# EAGLE schematic isp (EAGLE 9.6.2)

## Sheet 1 of 5
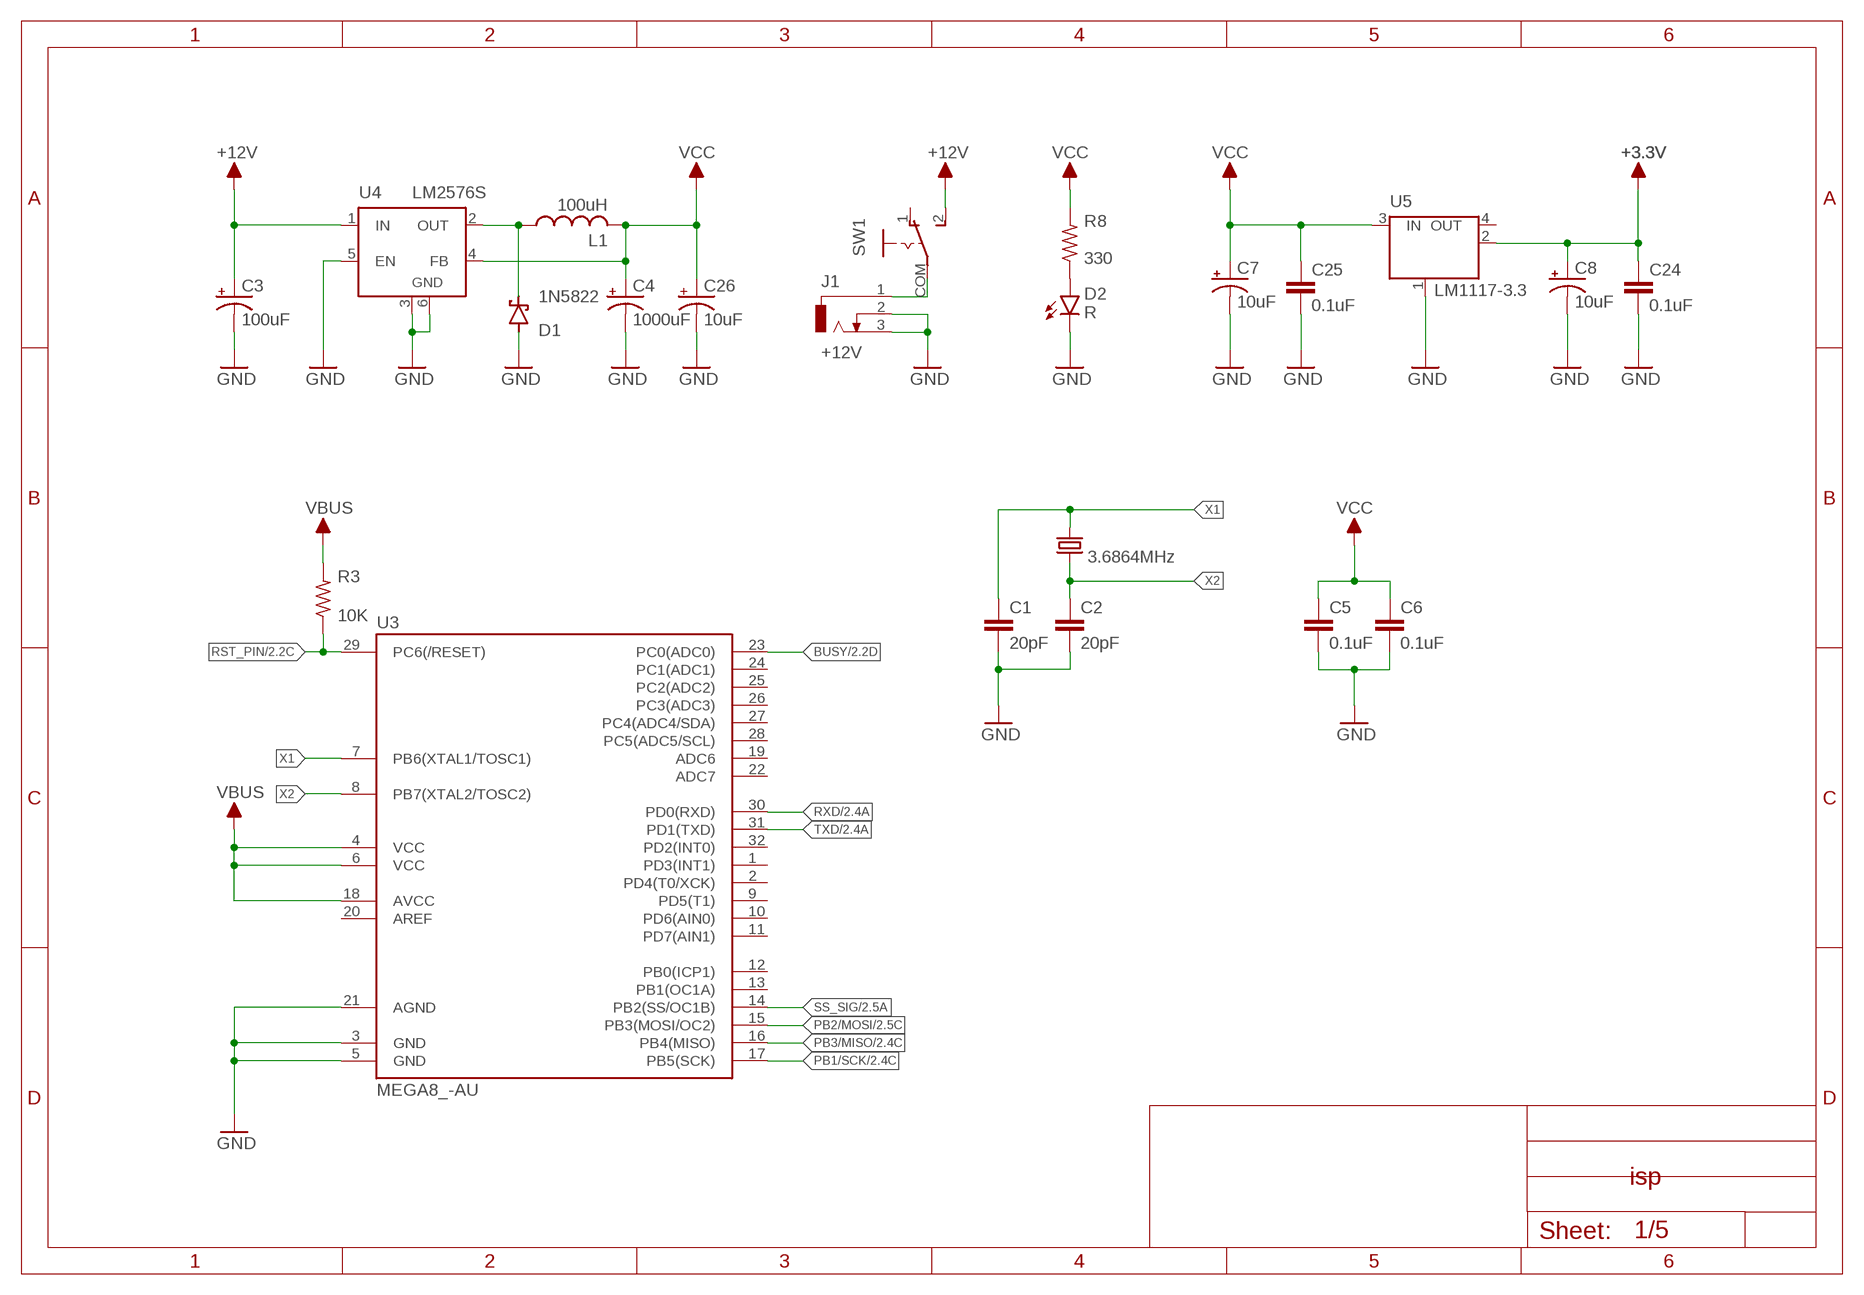
[diagram p0: schematic, sheet 1]

### Parts
C1  20pF  C-EUC0603  [C0603]
C2  20pF  C-EUC0603  [C0603]
C3  100uF  CPOL-US153CLV-0807  [153CLV-0807]
C4  1000uF  MVG_K14  [MVG_K14]
C5  0.1uF  C-EUC0603  [C0603]
C6  0.1uF  C-EUC0603  [C0603]
C7  10uF  CPOL-US153CLV-0605  [153CLV-0605]
C8  10uF  CPOL-US153CLV-0605  [153CLV-0605]
C24  0.1uF  C-EUC0603  [C0603]
C25  0.1uF  C-EUC0603  [C0603]
C26  10uF  CPOL-US153CLV-0605  [153CLV-0605]
D1  1N5822  15KEXXD  [DO201T15]
D2  R  LED3MM  [LED3MM]
J1  +12V  DCJ0303  [DCJ0303]
L1  100uH  SC1280S  [212-032T2]
R3  10K  R-US_R0603  [R0603]
R8  330  R-US_R0603  [R0603]
SW1  SLIDE-SW-DIP  [SLIDE-SW-DIP-SHIELD]
U3  MEGA8_-AU  [TQFP32-08]
U4  LM2576S  LM2596S  [TO263-5]
U5  LM1117-3.3  MC33269ST-3.3T3  [SOT223]
Y1  3.6864MHz  CRYSTALHC49UP  [HC49UP]

### Nets
+3.3V [VCCS]: C8.+ C24.1 U5.2(OUT) ; also sheet 3,5
+12V [12V]: C3.+ SW1.2 U4.1(IN) ; also sheet 5
BUSY: U3.23(PC0(ADC0)) ; also sheet 2
GND: C1.2 C2.2 C3.- C4.- C5.2 C6.2 C7.- C8.- C24.2 C25.2 C26.- D1.A D2.K(C) J1.2 J1.3 U3.3(GND) U3.5(GND) U3.21(AGND) U4.3(GND) U4.5(EN) U4.6(GND) U5.1(GND/ADJ) ; also sheet 2,3,4,5
N$2: D1.C L1.1 U4.2(OUT)
N$9: D2.A R8.1
N$11 [12V]: J1.1 SW1.COM
PB1/SCK: U3.17(PB5(SCK)) ; also sheet 2,3,4
PB2/MOSI: U3.15(PB3(MOSI/OC2)) ; also sheet 2,3,4
PB3/MISO: U3.16(PB4(MISO)) ; also sheet 2,3,4
RST_PIN: R3.1 U3.29(PC6(/RESET)) ; also sheet 2
RXD: U3.30(PD0(RXD)) ; also sheet 2
SS_SIG: U3.14(PB2(SS/OC1B)) ; also sheet 2
TXD: U3.31(PD1(TXD)) ; also sheet 2
VBUS: R3.2 U3.4(VCC) U3.6(VCC) U3.18(AVCC) ; also sheet 2
VCC [VCCS]: C4.+ C5.1 C6.1 C7.+ C25.1 C26.+ L1.2 R8.2 U4.4(FB) U5.3(IN) ; also sheet 3,4,5
X1: C1.1 U3.7(PB6(XTAL1/TOSC1)) Y1.2
X2: C2.1 U3.8(PB7(XTAL2/TOSC2)) Y1.1
Unconnected: SW1.1 U3.1(PD3(INT1)) U3.2(PD4(T0/XCK)) U3.9(PD5(T1)) U3.10(PD6(AIN0)) U3.11(PD7(AIN1)) U3.12(PB0(ICP1)) U3.13(PB1(OC1A)) U3.19(ADC6) U3.20(AREF) U3.22(ADC7) U3.24(PC1(ADC1)) U3.25(PC2(ADC2)) U3.26(PC3(ADC3)) U3.27(PC4(ADC4/SDA)) U3.28(PC5(ADC5/SCL)) U3.32(PD2(INT0)) U5.4(OUT)

## Sheet 2 of 5
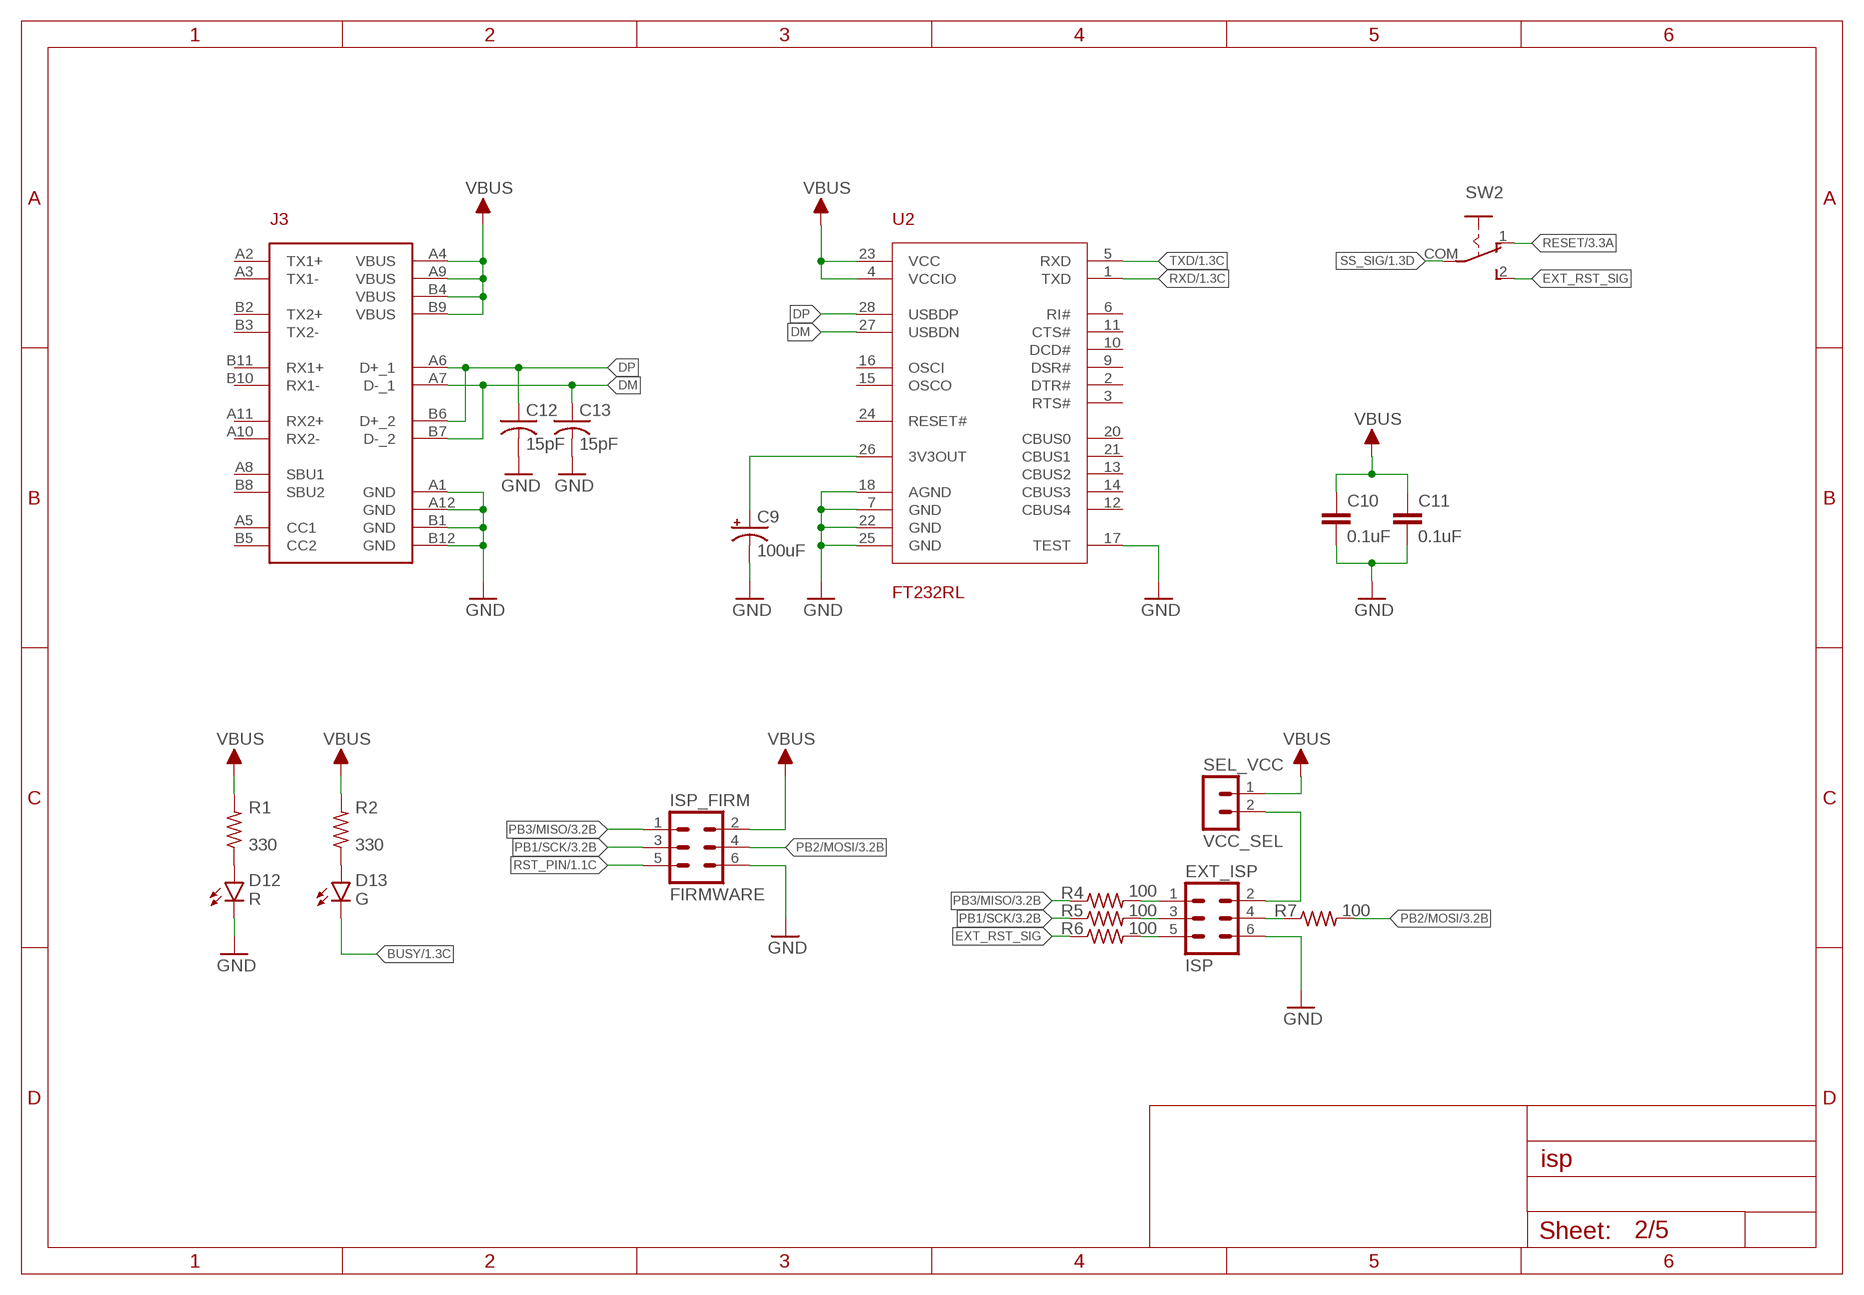
[diagram p1: schematic, sheet 2]

### Parts
C9  100uF  CPOL-US153CLV-0807  [153CLV-0807]
C10  0.1uF  C-EUC0603  [C0603]
C11  0.1uF  C-EUC0603  [C0603]
C12  15pF  C-USC0603  [C0603]
C13  15pF  C-USC0603  [C0603]
D12  R  LED3MM  [LED3MM]
D13  G  LED3MM  [LED3MM]
EXT_ISP  ISP  ML6  [ML6]
ISP_FIRM  FIRMWARE  MA03-2  [MA03-2]
J3  USB-C-SMD  [USB3.1-C-SMD]
R1  330  R-US_R0603  [R0603]
R2  330  R-US_R0603  [R0603]
R4  100  R-US_R0603  [R0603]
R5  100  R-US_R0603  [R0603]
R6  100  R-US_R0603  [R0603]
R7  100  R-US_R0603  [R0603]
SEL_VCC  VCC_SEL  MA02-1  [MA02-1]
SW2  SLIDE-SW-DIP  [SLIDE-SW-DIP-SHIELD]
U2  FT232RL  [SSOP28]

### Nets
BUSY: D13.K(C) ; also sheet 1
DM: C13.1 J3.A7(D-_1) J3.B7(D-_2) U2.27(USBDN)
DP: C12.1 J3.A6(D+_1) J3.B6(D+_2) U2.28(USBDP)
EXT_RST_SIG: R6.1 SW2.2
GND: C9.- C10.2 C11.2 C12.2 C13.2 D12.K(C) EXT_ISP.6 ISP_FIRM.6 J3.A1(GND) J3.A12(GND) J3.B1(GND) J3.B12(GND) U2.7(GND) U2.17(TEST) U2.18(AGND) U2.22(GND) U2.25(GND) ; also sheet 1,3,4,5
N$1: D12.A R1.1
N$3: D13.A R2.1
N$4: EXT_ISP.1 R4.2
N$5: EXT_ISP.3 R5.2
N$6: EXT_ISP.5 R6.2
N$7: EXT_ISP.4 R7.1
N$8: EXT_ISP.2 SEL_VCC.2
N$10: C9.+ U2.26(3V3OUT)
PB1/SCK: ISP_FIRM.3 R5.1 ; also sheet 1,3,4
PB2/MOSI: ISP_FIRM.4 R7.2 ; also sheet 1,3,4
PB3/MISO: ISP_FIRM.1 R4.1 ; also sheet 1,3,4
RESET: SW2.1 ; also sheet 3
RST_PIN: ISP_FIRM.5 ; also sheet 1
RXD: U2.1(TXD) ; also sheet 1
SS_SIG: SW2.COM ; also sheet 1
TXD: U2.5(RXD) ; also sheet 1
VBUS: C10.1 C11.1 ISP_FIRM.2 J3.A4(VBUS) J3.A9(VBUS) J3.B4(VBUS) J3.B9(VBUS) R1.2 R2.2 SEL_VCC.1 U2.4(VCCIO) U2.23(VCC) ; also sheet 1
Unconnected: J3.A2(TX1+) J3.A3(TX1-) J3.A5(CC1) J3.A8(SBU1) J3.A10(RX2-) J3.A11(RX2+) J3.B2(TX2+) J3.B3(TX2-) J3.B5(CC2) J3.B8(SBU2) J3.B10(RX1-) J3.B11(RX1+) U2.2(DTR#) U2.3(RTS#) U2.6(RI#) U2.8(NC) U2.9(DSR#) U2.10(DCD#) U2.11(CTS#) U2.12(CBUS4) U2.13(CBUS2) U2.14(CBUS3) U2.15(OSCO) U2.16(OSCI) U2.19(NC) U2.20(CBUS0) U2.21(CBUS1) U2.24(RESET#)

## Sheet 3 of 5
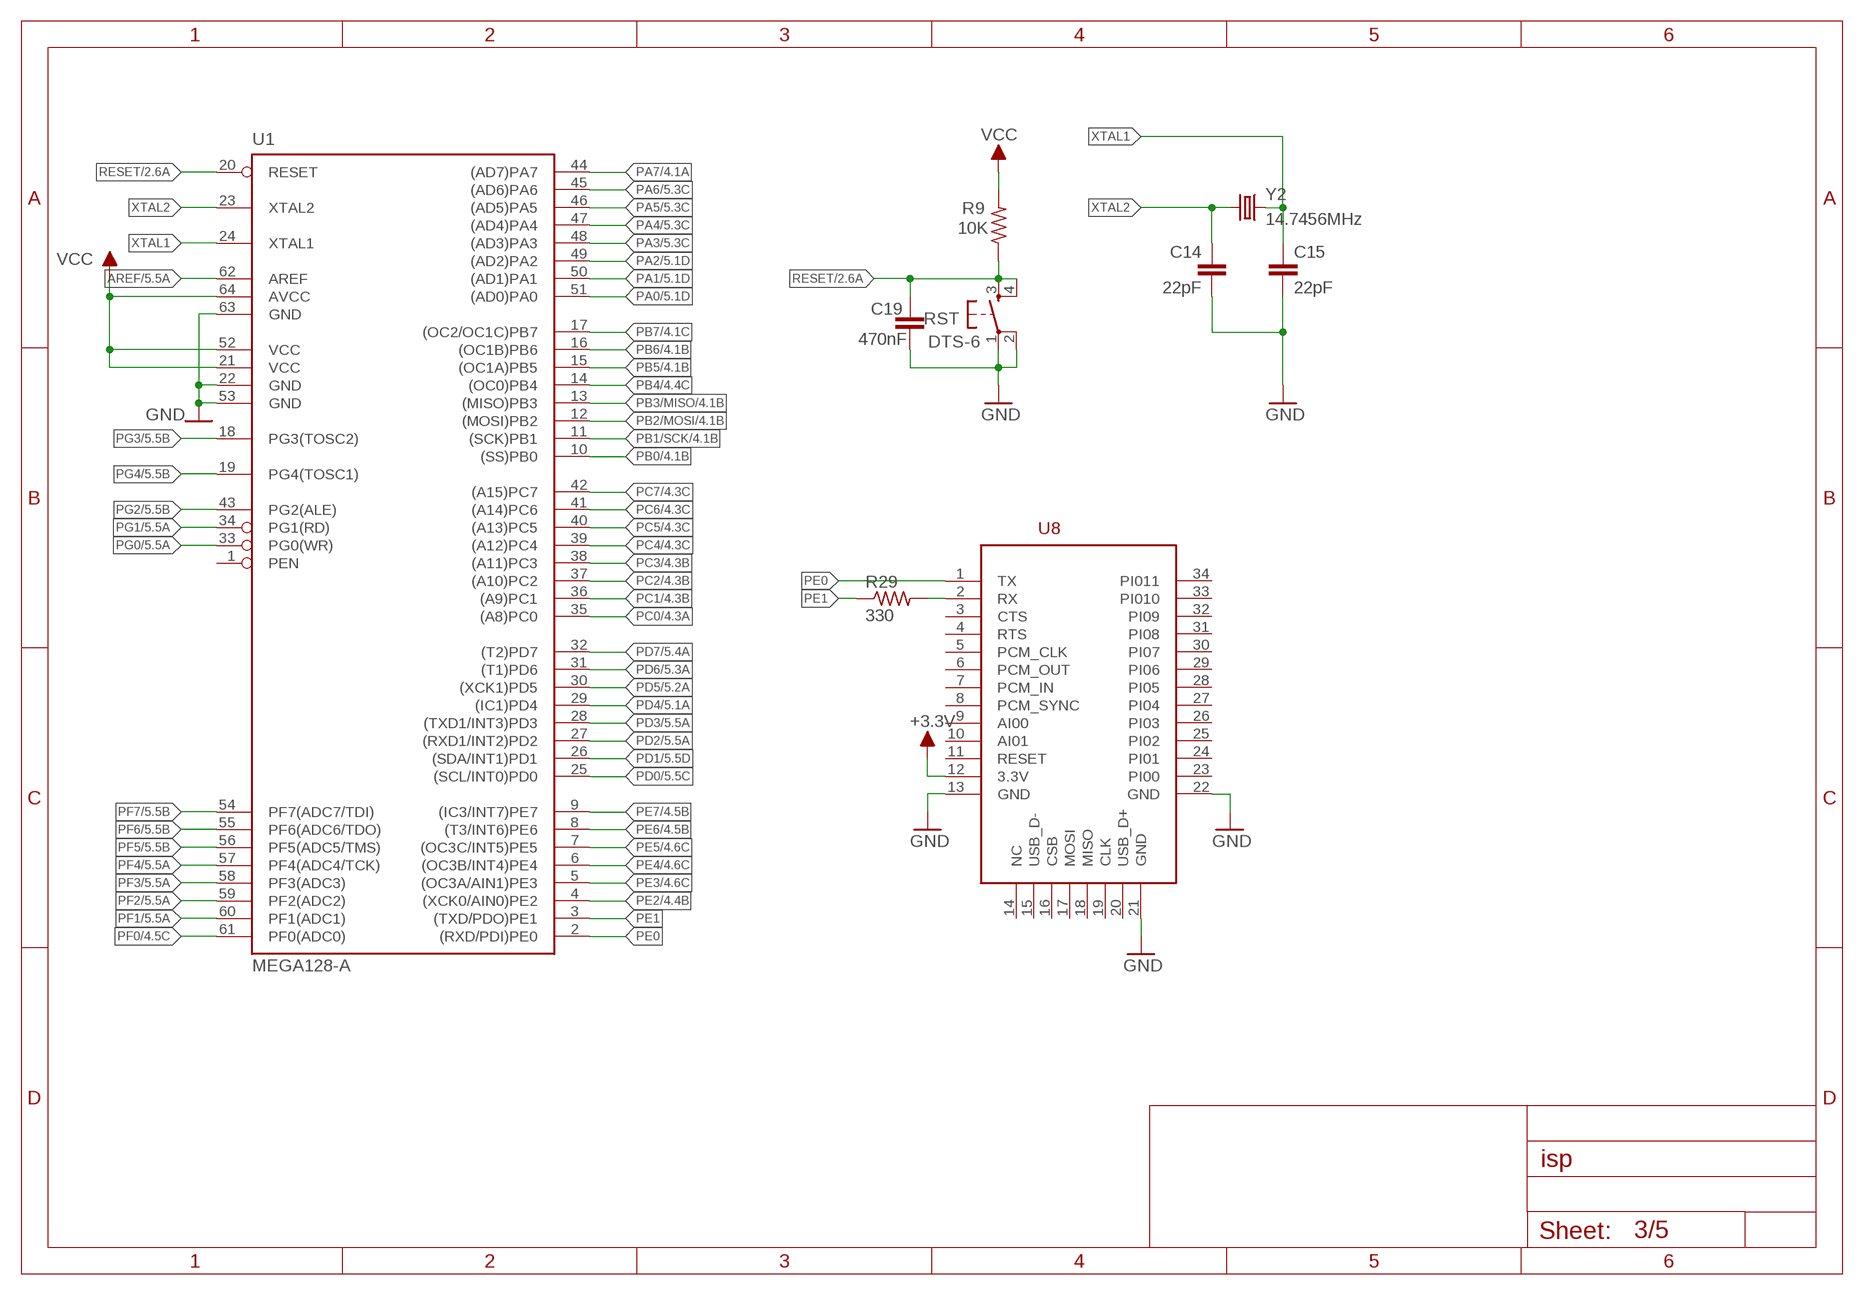
[diagram p2: schematic, sheet 3]

### Parts
C14  22pF  C-EUC0603  [C0603]
C15  22pF  C-EUC0603  [C0603]
C19  470nF  C-EUC1206  [C1206]
R9  10K  R-US_R0603  [R0603]
R29  330  R-US_R0603  [R0603]
RST  DTS-6  [DTS-6]
U1  MEGA128-A  [TQFP64]
U8  HC06-SMD  [HC06-SMD]
Y2  14.7456MHz  CRYSTALHC49UP  [HC49UP]

### Nets
+3.3V [VCCS]: U8.12(3.3V) ; also sheet 1,5
AREF: U1.62(AREF) ; also sheet 5
GND: C14.1 C15.2 C19.2 RST.1 RST.2 U1.22(GND) U1.53(GND) U1.63(GND) U8.13(GND) U8.21(GND) U8.22(GND) ; also sheet 1,2,4,5
N$28: R29.2 U8.2(RX)
PA0: U1.51((AD0)PA0) ; also sheet 5
PA1: U1.50((AD1)PA1) ; also sheet 5
PA2: U1.49((AD2)PA2) ; also sheet 5
PA3: U1.48((AD3)PA3) ; also sheet 5
PA4: U1.47((AD4)PA4) ; also sheet 5
PA5: U1.46((AD5)PA5) ; also sheet 5
PA6: U1.45((AD6)PA6) ; also sheet 5
PA7: U1.44((AD7)PA7) ; also sheet 4
PB0: U1.10((SS)PB0) ; also sheet 4
PB1/SCK: U1.11((SCK)PB1) ; also sheet 1,2,4
PB2/MOSI: U1.12((MOSI)PB2) ; also sheet 1,2,4
PB3/MISO: U1.13((MISO)PB3) ; also sheet 1,2,4
PB4: U1.14((OC0)PB4) ; also sheet 4
PB5: U1.15((OC1A)PB5) ; also sheet 4
PB6: U1.16((OC1B)PB6) ; also sheet 4
PB7: U1.17((OC2/OC1C)PB7) ; also sheet 4
PC0: U1.35((A8)PC0) ; also sheet 4
PC1: U1.36((A9)PC1) ; also sheet 4
PC2: U1.37((A10)PC2) ; also sheet 4
PC3: U1.38((A11)PC3) ; also sheet 4
PC4: U1.39((A12)PC4) ; also sheet 4
PC5: U1.40((A13)PC5) ; also sheet 4
PC6: U1.41((A14)PC6) ; also sheet 4
PC7: U1.42((A15)PC7) ; also sheet 4
PD0: U1.25((SCL/INT0)PD0) ; also sheet 5
PD1: U1.26((SDA/INT1)PD1) ; also sheet 5
PD2: U1.27((RXD1/INT2)PD2) ; also sheet 5
PD3: U1.28((TXD1/INT3)PD3) ; also sheet 5
PD4: U1.29((IC1)PD4) ; also sheet 5
PD5: U1.30((XCK1)PD5) ; also sheet 5
PD6: U1.31((T1)PD6) ; also sheet 5
PD7: U1.32((T2)PD7) ; also sheet 5
PE0: U1.2((RXD/PDI)PE0) U8.1(TX)
PE1: R29.1 U1.3((TXD/PDO)PE1)
PE2: U1.4((XCK0/AIN0)PE2) ; also sheet 4
PE3: U1.5((OC3A/AIN1)PE3) ; also sheet 4
PE4: U1.6((OC3B/INT4)PE4) ; also sheet 4
PE5: U1.7((OC3C/INT5)PE5) ; also sheet 4
PE6: U1.8((T3/INT6)PE6) ; also sheet 4
PE7: U1.9((IC3/INT7)PE7) ; also sheet 4
PF0: U1.61(PF0(ADC0)) ; also sheet 4
PF1: U1.60(PF1(ADC1)) ; also sheet 5
PF2: U1.59(PF2(ADC2)) ; also sheet 5
PF3: U1.58(PF3(ADC3)) ; also sheet 5
PF4: U1.57(PF4(ADC4/TCK)) ; also sheet 5
PF5: U1.56(PF5(ADC5/TMS)) ; also sheet 5
PF6: U1.55(PF6(ADC6/TDO)) ; also sheet 5
PF7: U1.54(PF7(ADC7/TDI)) ; also sheet 5
PG0: U1.33(PG0(WR)) ; also sheet 5
PG1: U1.34(PG1(RD)) ; also sheet 5
PG2: U1.43(PG2(ALE)) ; also sheet 5
PG3: U1.18(PG3(TOSC2)) ; also sheet 5
PG4: U1.19(PG4(TOSC1)) ; also sheet 5
RESET: C19.1 R9.1 RST.3 RST.4 U1.20(RESET) ; also sheet 2
VCC [VCCS]: R9.2 U1.21(VCC) U1.52(VCC) U1.64(AVCC) ; also sheet 1,4,5
XTAL1: C15.1 U1.24(XTAL1) Y2.1
XTAL2: C14.2 U1.23(XTAL2) Y2.2
Unconnected: U1.1(PEN) U8.3(CTS) U8.4(RTS) U8.5(PCM_CLK) U8.6(PCM_OUT) U8.7(PCM_IN) U8.8(PCM_SYNC) U8.9(AI00) U8.10(AI01) U8.11(RESET) U8.14(NC) U8.15(USB_D-) U8.16(CSB) U8.17(MOSI) U8.18(MISO) U8.19(CLK) U8.20(USB_D+) U8.23(PI00) U8.24(PI01) U8.25(PI02) U8.26(PI03) U8.27(PI04) U8.28(PI05) U8.29(PI06) U8.30(PI07) U8.31(PI08) U8.32(PI09) U8.33(PI010) U8.34(PI011)

## Sheet 4 of 5
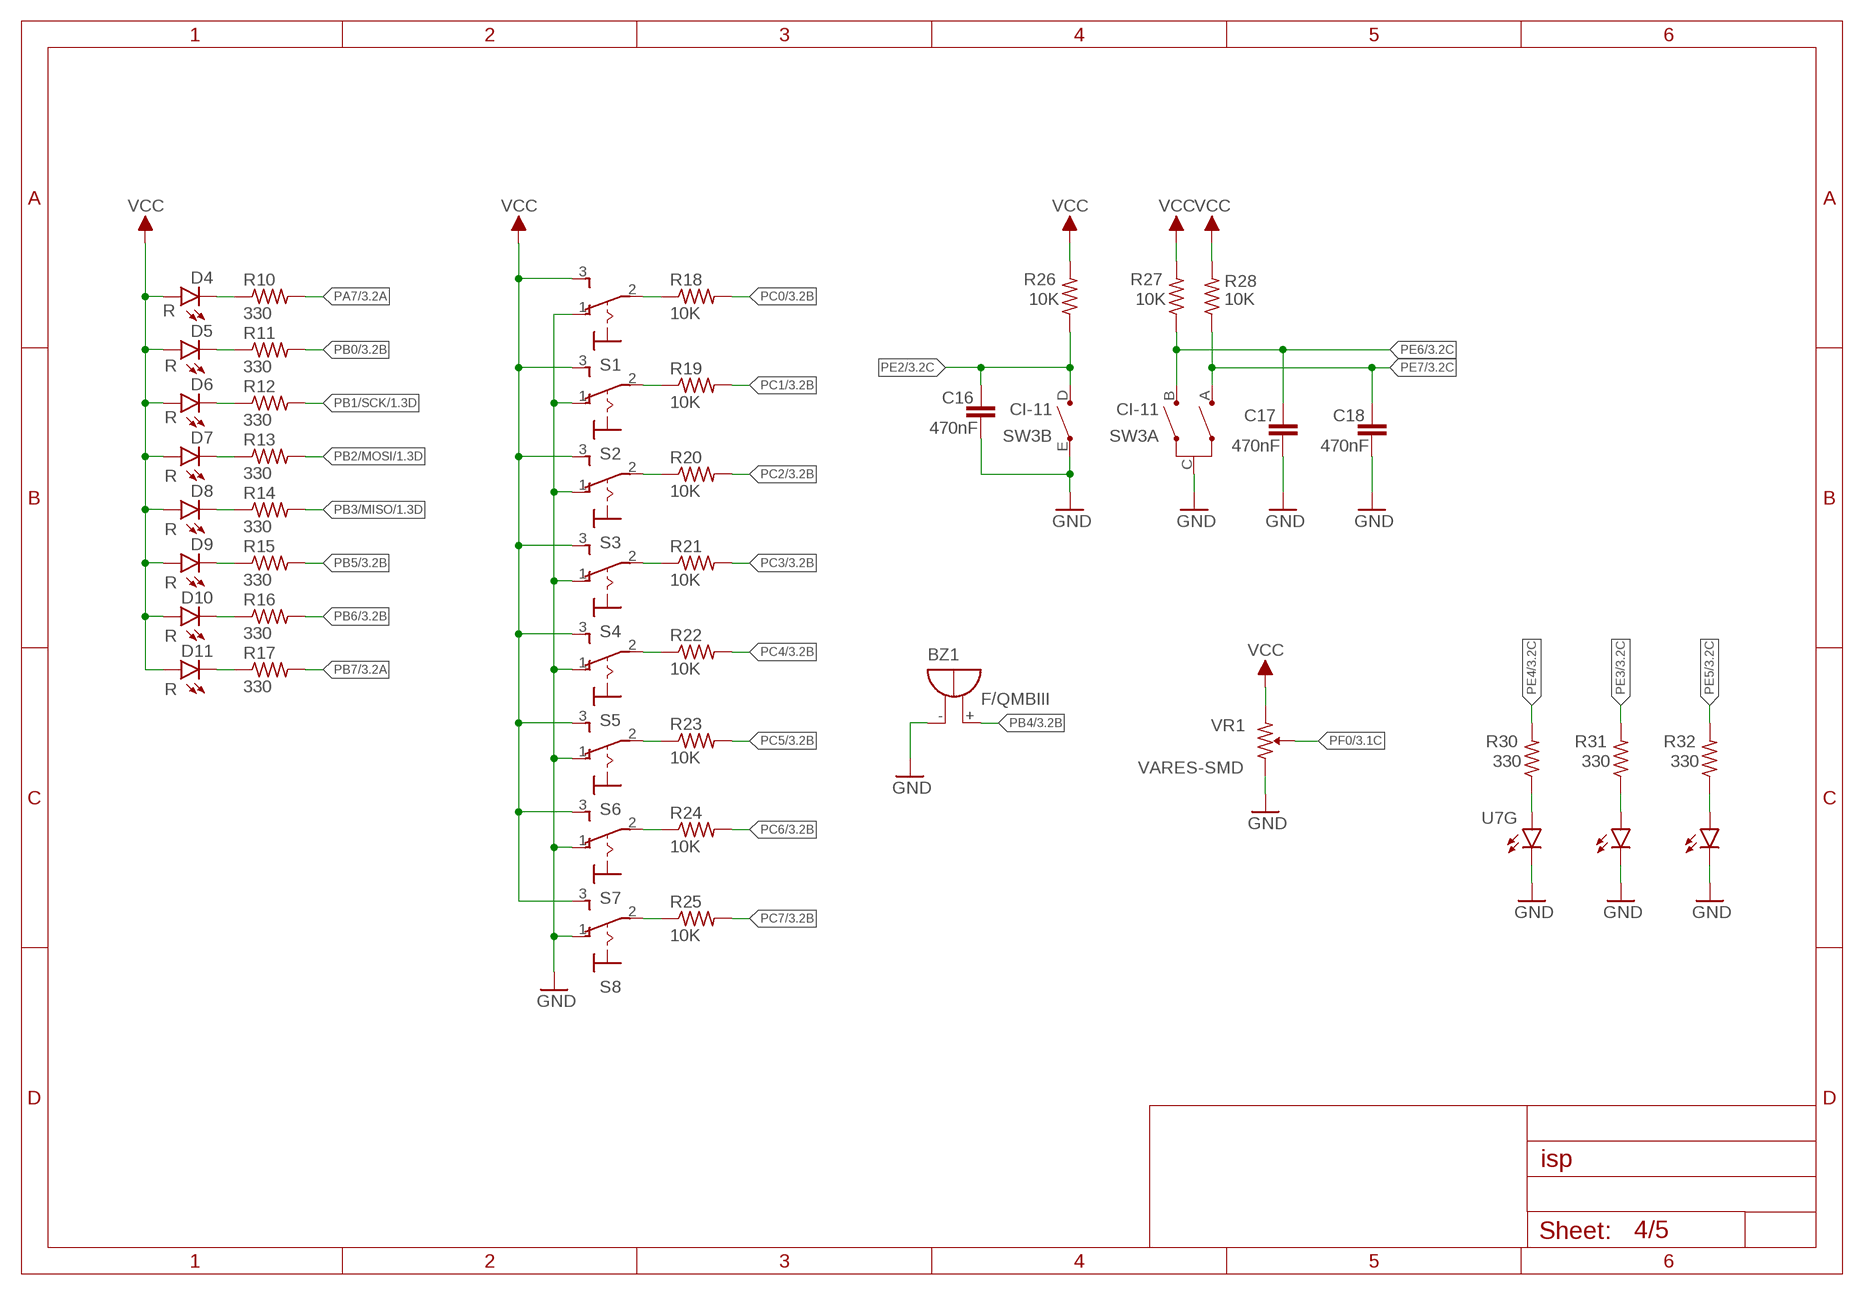
[diagram p3: schematic, sheet 4]

### Parts
BZ1  F/QMBIII  [F/QMBIII]
C16  470nF  C-EUC1206  [C1206]
C17  470nF  C-EUC1206  [C1206]
C18  470nF  C-EUC1206  [C1206]
D4  R  LED3MM  [LED3MM]
D5  R  LED3MM  [LED3MM]
D6  R  LED3MM  [LED3MM]
D7  R  LED3MM  [LED3MM]
D8  R  LED3MM  [LED3MM]
D9  R  LED3MM  [LED3MM]
D10  R  LED3MM  [LED3MM]
D11  R  LED3MM  [LED3MM]
R10  330  R-US_R0603  [R0603]
R11  330  R-US_R0603  [R0603]
R12  330  R-US_R0603  [R0603]
R13  330  R-US_R0603  [R0603]
R14  330  R-US_R0603  [R0603]
R15  330  R-US_R0603  [R0603]
R16  330  R-US_R0603  [R0603]
R17  330  R-US_R0603  [R0603]
R18  10K  R-US_R0603  [R0603]
R19  10K  R-US_R0603  [R0603]
R20  10K  R-US_R0603  [R0603]
R21  10K  R-US_R0603  [R0603]
R22  10K  R-US_R0603  [R0603]
R23  10K  R-US_R0603  [R0603]
R24  10K  R-US_R0603  [R0603]
R25  10K  R-US_R0603  [R0603]
R26  10K  R-US_R0603  [R0603]
R27  10K  R-US_R0603  [R0603]
R28  10K  R-US_R0603  [R0603]
R30  330  R-US_R0603  [R0603]
R31  330  R-US_R0603  [R0603]
R32  330  R-US_R0603  [R0603]
S1  M9040P  [M9040P]
S2  M9040P  [M9040P]
S3  M9040P  [M9040P]
S4  M9040P  [M9040P]
S5  M9040P  [M9040P]
S6  M9040P  [M9040P]
S7  M9040P  [M9040P]
S8  M9040P  [M9040P]
SW3  CI-11  [CI-11]
U7  LP2C63-ST-RGB-SR0  [LP2C63-ST-RGB-SR0]
VR1  VARES-SMD  [VARES-SMD]

### Nets
GND: BZ1.-(+) C16.2 C17.2 C18.2 S1.1(O) S2.1(O) S3.1(O) S4.1(O) S5.1(O) S6.1(O) S7.1(O) S8.1(O) SW3.C(A:C) SW3.E(B:E) U7.4(B:C) U7.5(R:C) U7.6(G:C) VR1.1 ; also sheet 1,2,3,5
N$12: D4.K(C) R10.1
N$13: D5.K(C) R11.1
N$14: D6.K(C) R12.1
N$15: D7.K(C) R13.1
N$16: D8.K(C) R14.1
N$17: D9.K(C) R15.1
N$18: D10.K(C) R16.1
N$19: D11.K(C) R17.1
N$20: R18.1 S1.2(P)
N$21: R19.1 S2.2(P)
N$22: R20.1 S3.2(P)
N$23: R21.1 S4.2(P)
N$24: R22.1 S5.2(P)
N$25: R23.1 S6.2(P)
N$26: R24.1 S7.2(P)
N$27: R25.1 S8.2(P)
N$29: R30.1 U7.1(G:A)
N$30: R31.1 U7.2(R:A)
N$31: R32.1 U7.3(B:A)
PA7: R10.2 ; also sheet 3
PB0: R11.2 ; also sheet 3
PB1/SCK: R12.2 ; also sheet 1,2,3
PB2/MOSI: R13.2 ; also sheet 1,2,3
PB3/MISO: R14.2 ; also sheet 1,2,3
PB4: BZ1.+(-) ; also sheet 3
PB5: R15.2 ; also sheet 3
PB6: R16.2 ; also sheet 3
PB7: R17.2 ; also sheet 3
PC0: R18.2 ; also sheet 3
PC1: R19.2 ; also sheet 3
PC2: R20.2 ; also sheet 3
PC3: R21.2 ; also sheet 3
PC4: R22.2 ; also sheet 3
PC5: R23.2 ; also sheet 3
PC6: R24.2 ; also sheet 3
PC7: R25.2 ; also sheet 3
PE2: C16.1 R26.1 SW3.D(B:D) ; also sheet 3
PE3: R31.2 ; also sheet 3
PE4: R30.2 ; also sheet 3
PE5: R32.2 ; also sheet 3
PE6: C17.1 R27.1 SW3.B(A:B) ; also sheet 3
PE7: C18.1 R28.1 SW3.A(A:A) ; also sheet 3
PF0: VR1.2 ; also sheet 3
VCC [VCCS]: D4.A D5.A D6.A D7.A D8.A D9.A D10.A D11.A R26.2 R27.2 R28.2 S1.3(S) S2.3(S) S3.3(S) S4.3(S) S5.3(S) S6.3(S) S7.3(S) S8.3(S) VR1.3 ; also sheet 1,3,5
Unconnected: U7.TH(TH:TH)

## Sheet 5 of 5
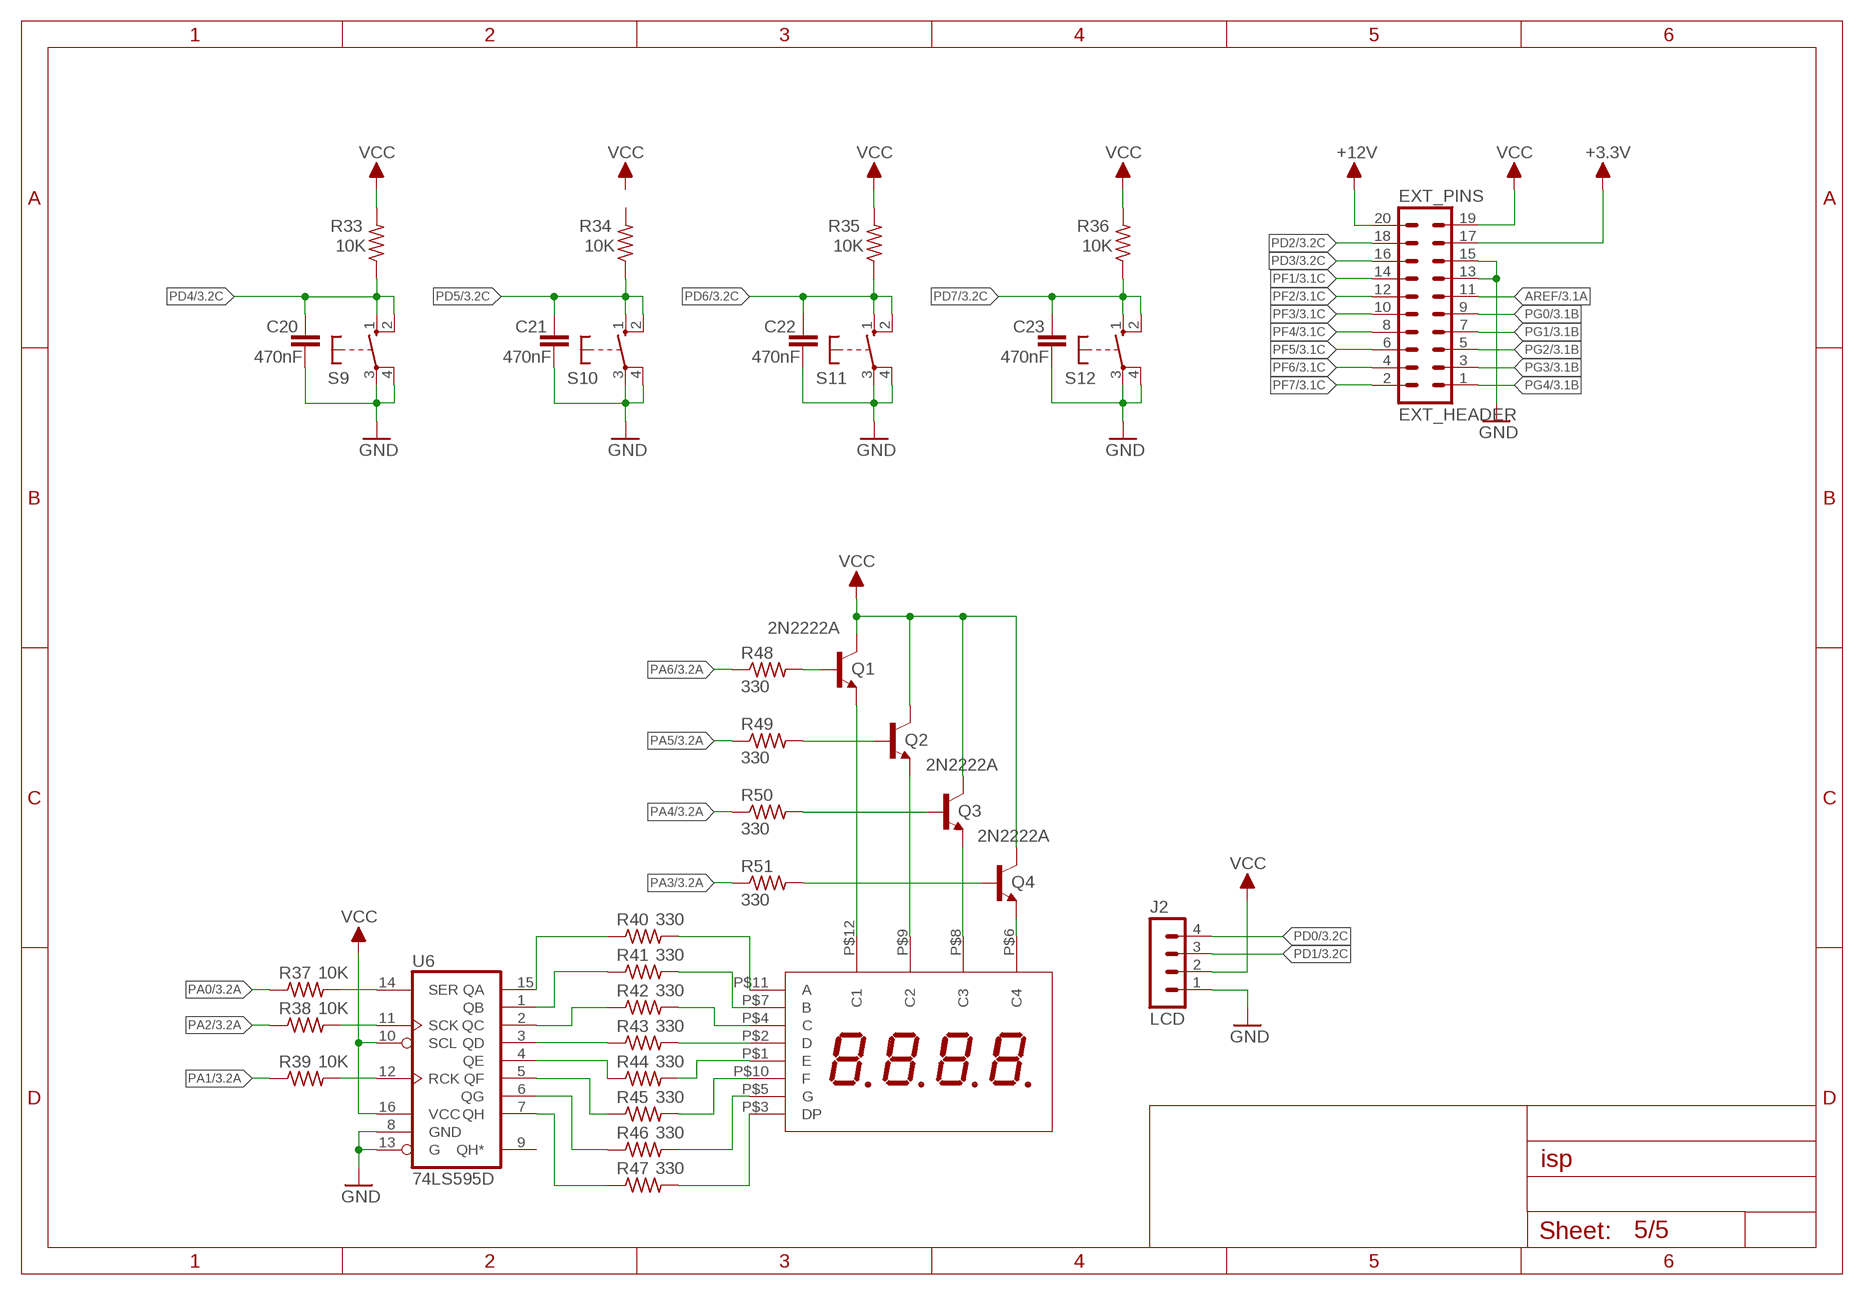
[diagram p4: schematic, sheet 5]

### Parts
C20  470nF  C-EUC1206  [C1206]
C21  470nF  C-EUC1206  [C1206]
C22  470nF  C-EUC1206  [C1206]
C23  470nF  C-EUC1206  [C1206]
D3  4CH_FND-DIP  [4CH_FND-DIP]
EXT_PINS  EXT_HEADER  MA10-2  [MA10-2]
J2  LCD  MA04-1  [MA04-1]
Q1  2N2222A  -NPN-TO92-EBC  [TO92-EBC]
Q2  2N2222A  -NPN-TO92-EBC  [TO92-EBC]
Q3  2N2222A  -NPN-TO92-EBC  [TO92-EBC]
Q4  2N2222A  -NPN-TO92-EBC  [TO92-EBC]
R33  10K  R-US_R0603  [R0603]
R34  10K  R-US_R0603  [R0603]
R35  10K  R-US_R0603  [R0603]
R36  10K  R-US_R0603  [R0603]
R37  10K  R-US_R0603  [R0603]
R38  10K  R-US_R0603  [R0603]
R39  10K  R-US_R0603  [R0603]
R40  330  R-US_R0603  [R0603]
R41  330  R-US_R0603  [R0603]
R42  330  R-US_R0603  [R0603]
R43  330  R-US_R0603  [R0603]
R44  330  R-US_R0603  [R0603]
R45  330  R-US_R0603  [R0603]
R46  330  R-US_R0603  [R0603]
R47  330  R-US_R0603  [R0603]
R48  330  R-US_R0603  [R0603]
R49  330  R-US_R0603  [R0603]
R50  330  R-US_R0603  [R0603]
R51  330  R-US_R0603  [R0603]
S9  RACON12  [RACON12]
S10  RACON12  [RACON12]
S11  RACON12  [RACON12]
S12  RACON12  [RACON12]
U6  74LS595D  [SO16]

### Nets
+3.3V [VCCS]: EXT_PINS.17 ; also sheet 1,3
+12V [12V]: EXT_PINS.20 ; also sheet 1
AREF: EXT_PINS.11 ; also sheet 3
GND: C20.2 C21.2 C22.2 C23.2 EXT_PINS.13 EXT_PINS.15 J2.1 S9.3(P) S9.4(P) S10.3(P) S10.4(P) S11.3(P) S11.4(P) S12.3(P) S12.4(P) U6.8(GND) U6.13(G) ; also sheet 1,2,3,4
N$32: R37.2 U6.14(SER)
N$33: R39.2 U6.12(RCK)
N$34: Q1.B R48.2
N$35: Q2.B R49.2
N$36: Q3.B R50.2
N$37: Q4.B R51.2
N$38: D3.P$12(C1) Q1.E
N$39: D3.P$9(C2) Q2.E
N$40: R38.2 U6.11(SCK)
N$41: R40.1 U6.15(QA)
N$42: R41.1 U6.1(QB)
N$43: R42.1 U6.2(QC)
N$44: R43.1 U6.3(QD)
N$45: R44.1 U6.4(QE)
N$46: R45.1 U6.5(QF)
N$47: R46.1 U6.6(QG)
N$48: R47.1 U6.7(QH)
N$49: D3.P$11(A) R40.2
N$50: D3.P$7(B) R41.2
N$51: D3.P$4(C) R42.2
N$52: D3.P$2(D) R43.2
N$53: D3.P$1(E) R44.2
N$54: D3.P$10(F) R45.2
N$55: D3.P$5(G) R46.2
N$56: D3.P$3(DP) R47.2
N$57: D3.P$8(C3) Q3.E
N$58: D3.P$6(C4) Q4.E
PA0: R37.1 ; also sheet 3
PA1: R39.1 ; also sheet 3
PA2: R38.1 ; also sheet 3
PA3: R51.1 ; also sheet 3
PA4: R50.1 ; also sheet 3
PA5: R49.1 ; also sheet 3
PA6: R48.1 ; also sheet 3
PD0: J2.4 ; also sheet 3
PD1: J2.3 ; also sheet 3
PD2: EXT_PINS.18 ; also sheet 3
PD3: EXT_PINS.16 ; also sheet 3
PD4: C20.1 R33.1 S9.1(S) S9.2(S) ; also sheet 3
PD5: C21.1 R34.1 S10.1(S) S10.2(S) ; also sheet 3
PD6: C22.1 R35.1 S11.1(S) S11.2(S) ; also sheet 3
PD7: C23.1 R36.1 S12.1(S) S12.2(S) ; also sheet 3
PF1: EXT_PINS.14 ; also sheet 3
PF2: EXT_PINS.12 ; also sheet 3
PF3: EXT_PINS.10 ; also sheet 3
PF4: EXT_PINS.8 ; also sheet 3
PF5: EXT_PINS.6 ; also sheet 3
PF6: EXT_PINS.4 ; also sheet 3
PF7: EXT_PINS.2 ; also sheet 3
PG0: EXT_PINS.9 ; also sheet 3
PG1: EXT_PINS.7 ; also sheet 3
PG2: EXT_PINS.5 ; also sheet 3
PG3: EXT_PINS.3 ; also sheet 3
PG4: EXT_PINS.1 ; also sheet 3
VCC [VCCS]: EXT_PINS.19 J2.2 Q1.C Q2.C Q3.C Q4.C R33.2 R35.2 R36.2 U6.10(SCL) U6.16(VCC) ; also sheet 1,3,4
Unconnected: R34.2 U6.9(QH*)

## Library data of the parts
BZ1 = buzzer:F/QMBIII: BUZZER Source: Buerklin; OC_FARNELL: unknown; OC_NEWARK: unknown
C1 C2 C5 C6 C10 C11 C14-C25 = rcl:C-EU: CAPACITOR, European symbol; SPICEPREFIX: C
C3 C7-C9 C26 = rcl:CPOL-US: POLARIZED CAPACITOR, American symbol; SPICEPREFIX: C
C4 = ARTMEGA:MVG_K14
C12 C13 = rcl:C-US: CAPACITOR, American symbol; SPICEPREFIX: C
D1 = diode:15KEXXD: DIODE
D2 D4-D13 = led:LED: LED OSRAM: - CHIPLED LG R971, LG N971, LY N971, LG Q971, LY Q971, LO R971, LY R971 LH N974, LH R974 LS Q976, LO Q976, LY Q976 LO Q996 - Hyper CHIPLED LW Q18S LB Q993, LB Q99A, LB R99A - SideLED LS A670, LO A670, LY A670, LG A670, LP A670 LB A673, LV A673, LT A673, LW A673 LH A674 LY A675 LS A676, LA A676, LO A676, LY A676, LW A676 LS A679, LY A679, LG A679 - Hyper Micro SIDELED® LS Y876, LA Y876, LO Y876, LY Y876 LT Y87S - SmartLED LW L88C, LW L88S LB L89C, LB L89S, LG L890 LS L89K, LO L89K, LY L89K LS L896, LA L896, LO L896, LY L896 - TOPLED LS T670, LO T670, LY T670, LG T670, LP T670 LSG T670, LSP T670, LSY T670, LOP T670, LYG T670 LG T671, LOG T671, LSG T671 LB T673, LV T673, LT T673, LW T673 LH T674 LS T676, LA T676, LO T676, LY T676, LB T676, LH T676, LSB T676, LW T676 LB T67C, LV T67C, LT T67C, LS T67K, LO T67K, LY T67K, LW E67C LS E67B, LA E67B, LO E67B, LY E67B, LB E67C, LV E67C, LT E67C LW T67C LS T679, LY T679, LG T679 LS T770, LO T770, LY T770, LG T770, LP T770 LB T773, LV T773, LT T773, LW T773 LH T774 LS E675, LA E675, LY E675, LS T675 LS T776, LA T776, LO T776, LY T776, LB T776 LHGB T686 LT T68C, LB T68C - Hyper Mini TOPLED® LB M676 - Mini TOPLED Santana® LG M470 LS M47K, LO M47K, LY M47K Source: http://www.osram.convergy.de LUXEON: - LUMILED® LXK2-PW12-R00, LXK2-PW12-S00, LXK2-PW14-U00, LXK2-PW14-V00 LXK2-PM12-R00, LXK2-PM12-S00, LXK2-PM14-U00 LXK2-PE12-Q00, LXK2-PE12-R00, LXK2-PE12-S00, LXK2-PE14-T00, LXK2-PE14-U00 LXK2-PB12-K00, LXK2-PB12-L00, LXK2-PB12-M00, LXK2-PB14-N00, LXK2-PB14-P00, LXK2-PB14-Q00 LXK2-PR12-L00, LXK2-PR12-M00, LXK2-PR14-Q00, LXK2-PR14-R00 LXK2-PD12-Q00, LXK2-PD12-R00, LXK2-PD12-S00 LXK2-PH12-R00, LXK2-PH12-S00 LXK2-PL12-P00, LXK2-PL12-Q00, LXK2-PL12-R00 Source: www.luxeon.com KINGBRIGHT: KA-3528ASYC Source: www.kingbright.com
D3 = ARTMEGA:4CH_FND-DIP
EXT_ISP = con-harting-ml:ML6: HARTING; OC_FARNELL: unknown; OC_NEWARK: unknown
EXT_PINS = con-lstb:MA10-2: PIN HEADER; OC_FARNELL: unknown; OC_NEWARK: unknown
ISP_FIRM = con-lstb:MA03-2: PIN HEADER; OC_FARNELL: unknown; OC_NEWARK: unknown
J1 = con-jack:DCJ0303: DC POWER JACK Source: DCJ0303.pdf; OC_FARNELL: unknown; OC_NEWARK: unknown
J2 = con-lstb:MA04-1: PIN HEADER; OC_FARNELL: unknown; OC_NEWARK: unknown
J3 = ARTMEGA:USB-C-SMD
L1 = ARTMEGA:SC1280S
Q1-Q4 = transistor-neu-to92:*-NPN-: NPN Transistror
R1-R51 = rcl:R-US_: RESISTOR, American symbol; SPICEPREFIX: R
RST = ARTMEGA:DTS-6
S1-S8 = ARTMEGA:M9040P: TOGGLE SWITCH Marquardt
S9-S12 = switch-misc:RACON12: ITT SWITCH
SEL_VCC = ARTMEGA:MA02-1
SW1 SW2 = ARTMEGA:SLIDE-SW-DIP
SW3 = piher:CI-11: 11mm Incemental Encoder Source: www.piher.net .. 04-CI-11v04.pdf; OC_FARNELL: unknown; OC_NEWARK: unknown
U1 = atmel:MEGA128: MICROCONTROLLER 128 Kbytes FLASH 4 Kbytes SRAM 4 Kbytes EEPROM DUAL USART 8-channel 10 bit ADC Source: avr.lbr; MPN: ATMEGA128-16AU; OC_FARNELL: 9171118; OC_NEWARK: 95K7364
U2 = ARTMEGA:FT232RL
U3 = avr-4:MEGA8_
U4 = linear:LM2596S: STEP-DOWN VOLTAGE REGULATOR
U5 = linear:MC33269ST*: Adjustable Output Low Dropout Voltage Regulator 800 mA Source: http://www.onsemi.com/pub/Collateral/MC33269-D.PDF
U6 = ARTMEGA:74*595: 8-bit SHIFT REGISTER, output latch
U7 = led:LP2C63-ST-RGB-SR0: 1.5W RGB HIGH POWER LED Source: http://www.ledtech.com.tw .. LP2C63-ST-RGB-SR0.SPEC.pdf
U8 = ARTMEGA:HC06-SMD
VR1 = ARTMEGA:VARES-SMD
Y1 Y2 = crystal:CRYSTAL: CRYSTAL; OC_FARNELL: unknown; OC_NEWARK: unknown

## Net classes
0 default: width 0.2 mm
1 12V: width 1.5 mm
2 VCCS: width 0.5 mm